# Altium schematic sheet Shield_robottino_schem.SchDoc
size A4
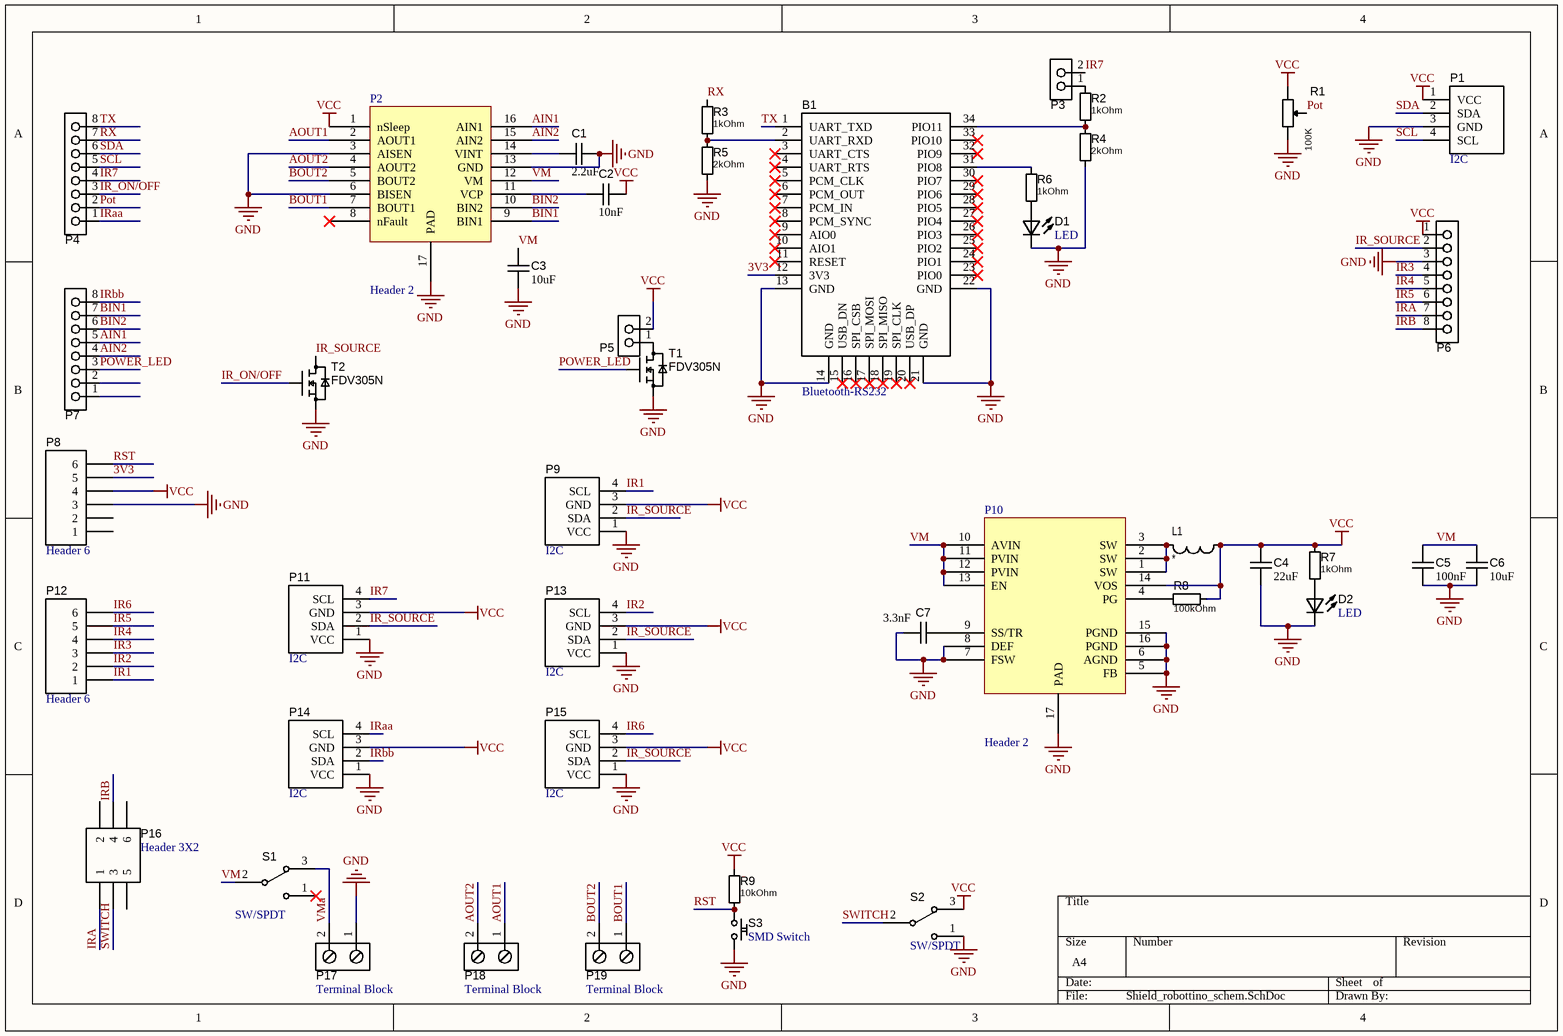
[diagram p0: Shield_robottino_schem.SchDoc]

## Parts
B1  Bluetooth-RS232  [Bluetooth_PRismino]
C1  value 2.2uF  [C/0805]  (hidden comment: C1)
C2  value 10nF  [C/0805]  (hidden comment: C2)
C3  value 10uF  [C/0805]  (hidden comment: C3)
C4  value 22uF  [C/0805]  (hidden comment: C4)
C5  value 100nF  [C/0805]  (hidden comment: C6)
C6  value 10uF  [C/0805]  (hidden comment: C7)
C7  value 3.3nF  [C/0805]  (hidden comment: C5)
D1  LED  [LED-2012[0805]]
D2  LED  [LED-2012[0805]]
L1  *  [RL622-2R2K-RC]
P1  I2C  [TYCO/215079-4]
P2  Header 2  [DRV8833PWPR]
P3  Header 2  [HEADER1x2]  (value not drawn)
P4  Header 8  [Arduino Pad 8]  (value not drawn)
P5  Header 2  [HEADER1x2]  (value not drawn)
P6  Header 8  [TYCO/215079-8]  (value not drawn)
P7  Header 8  [Arduino Pad 8]  (value not drawn)
P8  Header 6  [Arduino Pad 6]
P9  I2C  [TYCO/215079-4]
P10  Header 2  [TPS62133 - duplicate]
P11  I2C  [TYCO/215079-4]
P12  Header 6  [Arduino Pad 6]
P13  I2C  [TYCO/215079-4]
P14  I2C  [TYCO/215079-4]
P15  I2C  [TYCO/215079-4]
P16  Header 3X2  [HEADER2X3]
P17  Terminal Block  [Phoenix PT 2-Pole]
P18  Terminal Block  [Phoenix PT 2-Pole]
P19  Terminal Block  [Phoenix PT 2-Pole]
R1  value 100K  [POT/Bourns-3362P]  (hidden comment: POT_Bourns)
R2  1kOhm  [R/0805]
R3  1kOhm  [R/0805]
R4  2kOhm  [R/0805]
R5  2kOhm  [R/0805]
R6  1kOhm  [R/0805]
R7  1kOhm  [R/0805]
R8  100kOhm  [R/0805]
R9  10kOhm  [R/0805]
S1  SW/SPDT  [SW/OS-SPDT]
S2  SW/SPDT  [SW/OS-SPDT]
S3  SMD Switch  [SMD_SW_Red]
T1  FDV305N  [SOT23-3]
T2  FDV305N  [SOT23-3]

## Nets
GND: B1.13(GND) B1.14(GND) B1.21(GND) B1.22(GND) C1.2 C3.1 C4.1 C5.1 C6.1 C7.1 D1.K D2.K P1.3(GND) P2.3(AISEN) P2.6(BISEN) P2.13(GND) P2.17(PAD) P6.3 P8.3 P9.1(VCC) P10.5(FB) P10.6(AGND) P10.7(FSW) P10.8(DEF) P10.15(PGND) P10.16(PGND) P10.17(PAD) P11.1(VCC) P13.1(VCC) P14.1(VCC) P15.1(VCC) P17.1 R1.3 R4.1 R5.1 S2.1 S3.2 T1.2(S) T2.2(S)
VCC: C2.2 C4.2 L1.2 P1.1(VCC) P2.1(nSleep) P5.2 P6.1 P8.4 P9.3(GND) P10.14(VOS) P11.3(GND) P13.3(GND) P14.3(GND) P15.3(GND) R1.1 R7.2 R8.2 R9.2 S2.3
3V3: B1.12(3V3) P8.5
AIN1: P2.16(AIN1) P7.5
AIN2: P2.15(AIN2) P7.4
AOUT1: P2.2(AOUT1) P18.1
AOUT2: P2.4(AOUT2) P18.2
BIN1: P2.9(BIN1) P7.7
BIN2: P2.10(BIN2) P7.6
BOUT1: P2.7(BOUT1) P19.1
BOUT2: P2.5(BOUT2) P19.2
IR1: P9.4(SCL) P12.1
IR2: P12.2 P13.4(SCL)
IR3: P6.4 P12.3
IR4: P6.5 P12.4
IR5: P6.6 P12.5
IR6: P12.6 P15.4(SCL)
IR7: P3.2 P4.4 P11.4(SCL)
IR_ON/OFF: P4.3 T2.1(G)
IR_SOURCE: P6.2 P9.2(SDA) P11.2(SDA) P13.2(SDA) P15.2(SDA) T2.3(D)
IRA: P6.7 P16.1
IRaa: P4.1 P14.4(SCL)
IRB: P6.8 P16.4
IRbb: P7.8 P14.2(SDA)
Pot: P4.2 R1.2
POWER_LED: P7.3 T1.1(G)
RST: P8.6 R9.1 S3.1
RX: P4.7 R3.2
SCL: P1.4(SCL) P4.5
SDA: P1.2(SDA) P4.6
SWITCH: P16.3 S2.2
TX: B1.1(UART_TXD) P4.8
VM: C3.2 C5.2 C6.2 P2.12(VM) P10.10(AVIN) P10.11(PVIN) P10.12(PVIN) P10.13(EN) S1.2
VMa: P17.2 S1.3
NetB1_2: B1.2(UART_RXD) R3.1 R5.2
NetB1_31: B1.31(PIO8) R6.2
NetB1_34: B1.34(PIO11) R2.1 R4.2
NetC1_1: C1.1 P2.14(VINT)
NetC2_1: C2.1 P2.11(VCP)
NetC7_2: C7.2 P10.9(SS/TR)
NetD1_A: D1.A R6.1
NetD2_A: D2.A R7.1
NetL1_1: L1.1 P10.1(SW) P10.2(SW) P10.3(SW)
NetP3_1: P3.1 R2.2
NetP5_1: P5.1 T1.3(D)
NetP10_4: P10.4(PG) R8.1

Not connected (* = marked no-connect by the designer): B1 3(UART_CTS)* 4(UART_RTS)* 5(PCM_CLK)* 6(PCM_OUT)* 7(PCM_IN)* 8(PCM_SYNC)* 9(AIO0)* 10(AIO1)* 11(RESET)* 15(USB_DN)* 16(SPI_CSB)* 17(SPI_MOSI)* 18(SPI_MISO)* 19(SPI_CLK)* 20(USB_DP)* 23(PIO0)* 24(PIO1)* 25(PIO2)* 26(PIO3)* 27(PIO4)* 28(PIO5)* 29(PIO6)* 30(PIO7)* 32(PIO9)* 33(PIO10)*; P2 8(nFault)*; P7 1 2; P8 1 2; P16 2 5 6; S1 1*

## Library data of the parts
B1 = Bluetooth-RS232: Bluetooth to RS232 Module
C1-C7 = C: Capacitor; Published: 8-Jun-2000; LatestRevisionDate: 17-Jul-2002; LatestRevisionNote: Re-released for DXP Platform.; PackageReference: RAD-0.3; Publisher: Altium Limited
L1 = L: Value: *; Isat: *
P1 P9 P11 P13-P15 = Micromatch-I2C: Micromatch I2C Connector
P2 = DRV8833PWPR: Header, 2-Pin; LatestRevisionDate: 17-Jul-2002; LatestRevisionNote: Re-released for DXP Platform.; Publisher: Altium Limited
P3 P5 = Header 2: Header, 2-Pin; LatestRevisionDate: 17-Jul-2002; LatestRevisionNote: Re-released for DXP Platform.; Publisher: Altium Limited
P4 P6 P7 = Header 8: Header, 8-Pin; LatestRevisionDate: 17-Jul-2002; LatestRevisionNote: Re-released for DXP Platform.; Publisher: Altium Limited
P8 P12 = Header 6: Header, 6-Pin; LatestRevisionDate: 17-Jul-2002; LatestRevisionNote: Re-released for DXP Platform.; Publisher: Altium Limited
P10 = TPS62133: Header, 2-Pin; LatestRevisionDate: 17-Jul-2002; LatestRevisionNote: Re-released for DXP Platform.; Publisher: Altium Limited
P16 = Header 3X2: Header, 3-Pin, Dual row; LatestRevisionDate: 17-Jul-2002; LatestRevisionNote: Re-released for DXP Platform.; Publisher: Altium Limited
P17-P19 = Screw Block 2: 2-Pin Screw Terminal; LatestRevisionDate: 17-Jul-2002; LatestRevisionNote: Re-released for DXP Platform.; Publisher: Altium Limited
R1 = POT_Bourns: Potentiometer; Published: 8-Jun-2000; LatestRevisionDate: 17-Jul-2002; LatestRevisionNote: Re-released for DXP Platform.; PackageReference: AXIAL-0.4; Publisher: Altium Limited
R2-R9 = R: Resistor; Published: 8-Jun-2000; LatestRevisionDate: 17-Jul-2002; LatestRevisionNote: Re-released for DXP Platform.; PackageReference: AXIAL-0.4; Publisher: Altium Limited
  R2 R3 R6 R7: Value: 1kOhm
  R4 R5: Value: 2kOhm
  R8: Value: 100kOhm
  R9: Value: 10kOhm
S1 S2 = SW-SPDT: SPDT Subminiature Toggle Switch, Right Angle Mounting, Vertical Actuation; Published: 24-Mar-1999; LatestRevisionDate: 17-Dec-2003; LatestRevisionNote: Schematic revised, PCB Footprint replaced.; DatasheetVersion: 05-Dec-2000; PackageReference: TL36WW15050; Publisher: Altium Limited; PackageDescription: Switch; 4 Leads; ComponentLink1Description: Manufacturer Link; ComponentLink1URL: http://www.apem.com
S3 = SMD Switch: Switch; Published: 24-Mar-1999; LatestRevisionDate: 17-Jul-2002; LatestRevisionNote: Re-released for DXP Platform.; PackageReference: SPST-2; Publisher: Altium Limited
T1 T2 = T/FDV305N: MOSFET N SOT-23 20V 220mOhm; Supplier 1: Digi-Key; Supplier Part Number 1: FDV305NCT-ND
D1 D2 = LED: Published: 8-Jun-2000; LatestRevisionDate: 08-Jul-2005; LatestRevisionNote: Mech Layer 1 removed.; PackageReference: LED-0; Publisher: Altium Limited